# Altium schematic sheet Current_measurement.SchDoc
size 254 x 208 mm; Date: 02/01/2024; CheckedBy: Group 12; DrawnBy: Group 12; DocumentNumber: 01; Revision: 01; SheetNumber: 1; SheetTotal: 1; Application_BuildNumber: 01
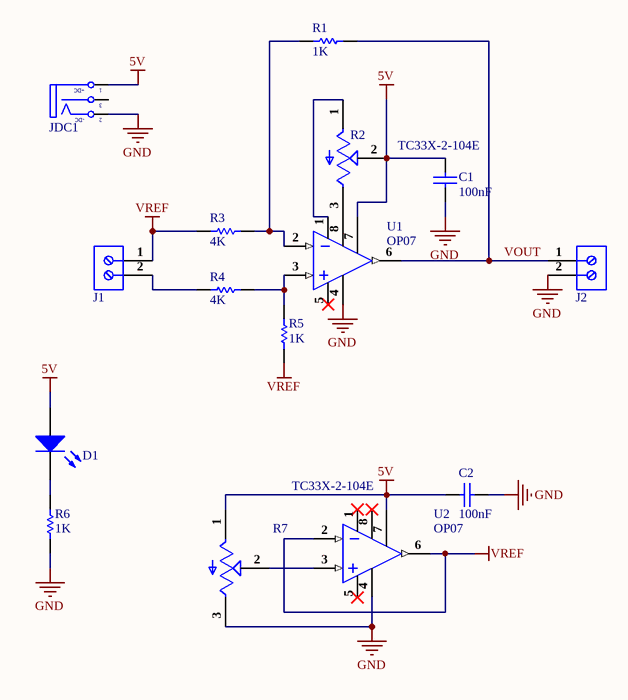
[diagram p0: Current_measurement.SchDoc]

## Parts
C1  value 100nF  [CAP-SM-0805]  (hidden comment: Cap Non-Pol SMD)
C2  value 100nF  [CAP-SM-0805]  (hidden comment: Cap Non-Pol SMD)
D1  LED SMD  [LED_0805_Blue]  (value not drawn)
J1  691214300002  [691214300002]  (value not drawn)
J2  691214300002  [691214300002]  (value not drawn)
JDC1  Jack DC  [DC-IN]  (value not drawn)
R1  value 1K  [RES-SM-0805]  (hidden comment: RESISTOR SMD)
R2  TC33X-2-104E  [TRIM_TC33X-2-104E]
R3  value 4K  [RES-SM-0805]  (hidden comment: RESISTOR SMD)
R4  value 4K  [RES-SM-0805]  (hidden comment: RESISTOR SMD)
R5  value 1K  [RES-SM-0805]  (hidden comment: RESISTOR SMD)
R6  value 1K  [RES-SM-0805]  (hidden comment: RESISTOR SMD)
R7  TC33X-2-104E  [TRIM_TC33X-2-104E]
U1  OP07  [SOIC8-OP07]
U2  OP07  [SOIC8-OP07]

## Nets
5V: C1.2 C2.2 D1.1(A) JDC1.1(T) R2.2(W) R7.1(CCW) U1.7(+V) U2.7(+V)
GND: C1.1 C2.1 J2.2 JDC1.2(TN) R6.2 R7.3(CW) U1.4(-V) U2.4(-V)
VREF: J1.1 R3.1 R5.2 U2.2(IN-) U2.6(OUT)
VOUT: J2.1 R1.2 U1.6(OUT)
NetD1_2: D1.2(K) R6.1
NetJ1_2: J1.2 R4.1
NetR1_1: R1.1 R3.2 U1.2(IN-)
NetR2_1: R2.1(CCW) U1.1(NULL)
NetR2_3: R2.3(CW) U1.8(NULL)
NetR4_2: R4.2 R5.1 U1.3(IN+)
NetR7_2: R7.2(W) U2.3(IN+)

Not connected (* = marked no-connect by the designer): JDC1 3(S); U1 5*; U2 1(NULL)* 5* 8(NULL)*

## Notes on the sheet
- Title
- Size
- Date:
- A4
- Number
- Check by:
- Revision
- Sheet of:
- Draw by:
- (in symbol Jack DC) +DC; -DC

## Library data of the parts
C1 C2 = Cap Non-Pol SMD: Capacitor
D1 = LED SMD: LED
J1 J2 = 691214300002: WR-TBL Series 2143 Vertical Entry Modular, Through Hole, pitch 3.81mm, 2p; Manufacturer: Wurth Elektronik; Pin Number: 2; Rated Current: 10A; Working Voltage: 300V; PCB/Cable/Panel: PCB; Modularity: Yes; ComponentLink1Description: Manufacturer Link; ComponentLink1URL: https://www.we-online.com/redexpert/article/691214300002?ad; ComponentLink2Description: Datasheet; ComponentLink2URL: https://www.we-online.com/redexpert/spec/691214300002?ad; Category: Terminal Blocks; Match Code: WR-TBL; Manufacturer Part Number: 691214300002; Mount: Through Hole; Operating Temperature Max: 120°C; Operating Temperature Min: -30°C; Packaging: Box; Pitch: 3.81mm; Orientation: Vertical; Application: Rising Cage Clamp
JDC1 = Jack DC: Jack DC input; Value: Jac DC
R1 R3-R6 = RESISTOR SMD: Resistor
R2 R7 = TC33X-2-104E: 100 kOhms 0.1W, 1/10W J Lead Surface Mount Trimmer Potentiometer Cermet 1 Turn Top Adjustment; MF: Bourns; Package: SOD-23 Bourns; Availability: Unavailable; MP: TC33X-2-104E; Value: *; SnapEDA_Link: https://www.snapeda.com/parts/TC33X-2-104E/Bourns/view-part/50727/?ref=snap; Price: None